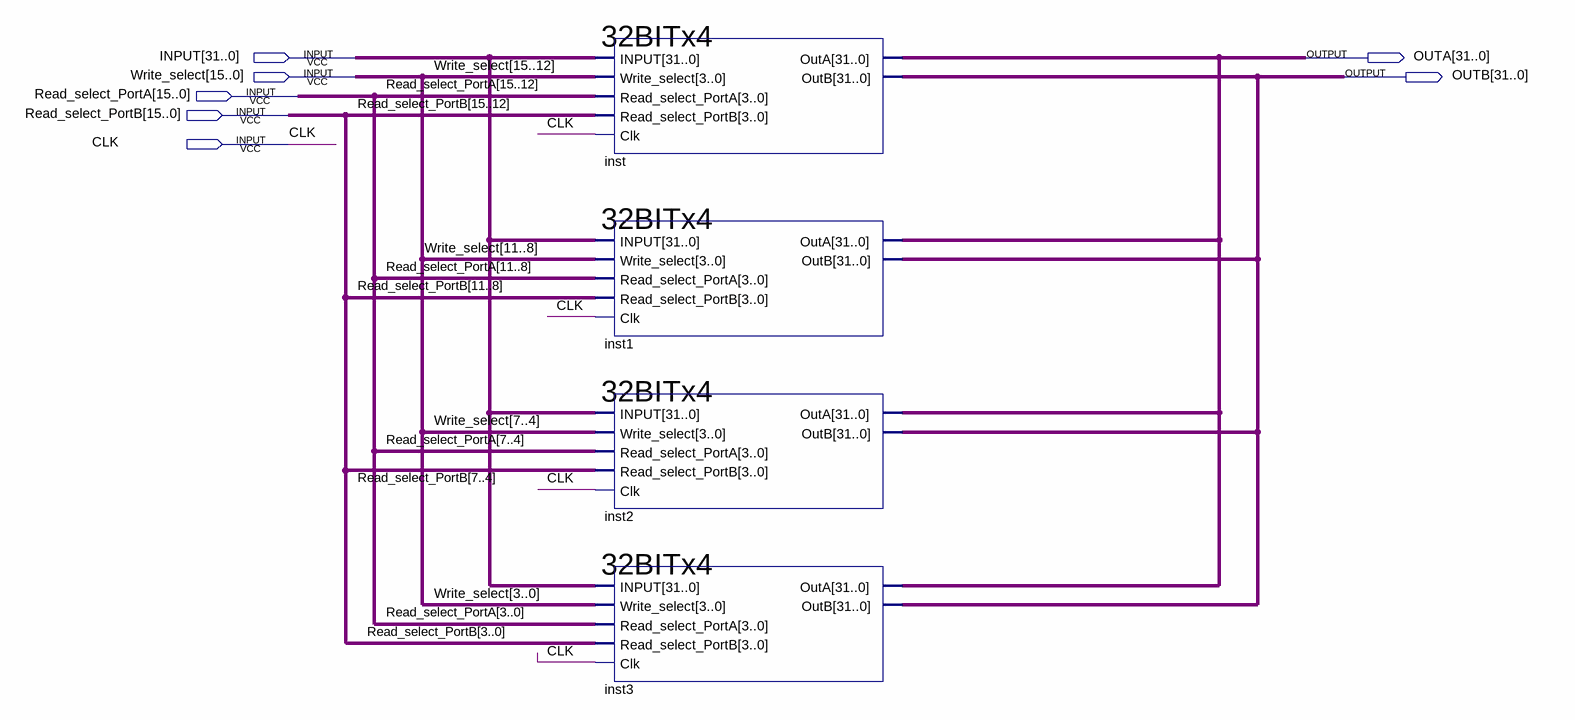
[diagram p0: schematic sheet]
// Quartus schematic 32BITx16.bdf as structural Verilog: 4 symbols, 7 pins
module \32BITx16  (
  input  [31:0] INPUT,
  input  [15:0] Write_select,
  input  [15:0] Read_select_PortA,
  input  [15:0] Read_select_PortB,
  input  CLK,
  output [31:0] OUTA,
  output [31:0] OUTB
);

  \32BITx4  inst (
    .INPUT(INPUT), .Write_select(Write_select[15:12]), .Read_select_PortA(Read_select_PortA[15:12]),
    .Read_select_PortB(Read_select_PortB[15:12]), .Clk(CLK), .OutA(OUTA), .OutB(OUTB));
  \32BITx4  inst1 (
    .INPUT(INPUT), .Write_select(Write_select[11:8]), .Read_select_PortA(Read_select_PortA[11:8]),
    .Read_select_PortB(Read_select_PortB[11:8]), .Clk(CLK), .OutA(OUTA), .OutB(OUTB));
  \32BITx4  inst2 (
    .INPUT(INPUT), .Write_select(Write_select[7:4]), .Read_select_PortA(Read_select_PortA[7:4]),
    .Read_select_PortB(Read_select_PortB[7:4]), .Clk(CLK), .OutA(OUTA), .OutB(OUTB));
  \32BITx4  inst3 (
    .INPUT(INPUT), .Write_select(Write_select[3:0]), .Read_select_PortA(Read_select_PortA[3:0]),
    .Read_select_PortB(Read_select_PortB[3:0]), .Clk(CLK), .OutA(OUTA), .OutB(OUTB));
endmodule
